# Altium schematic sheet Input Filtering.SchDoc
size A4
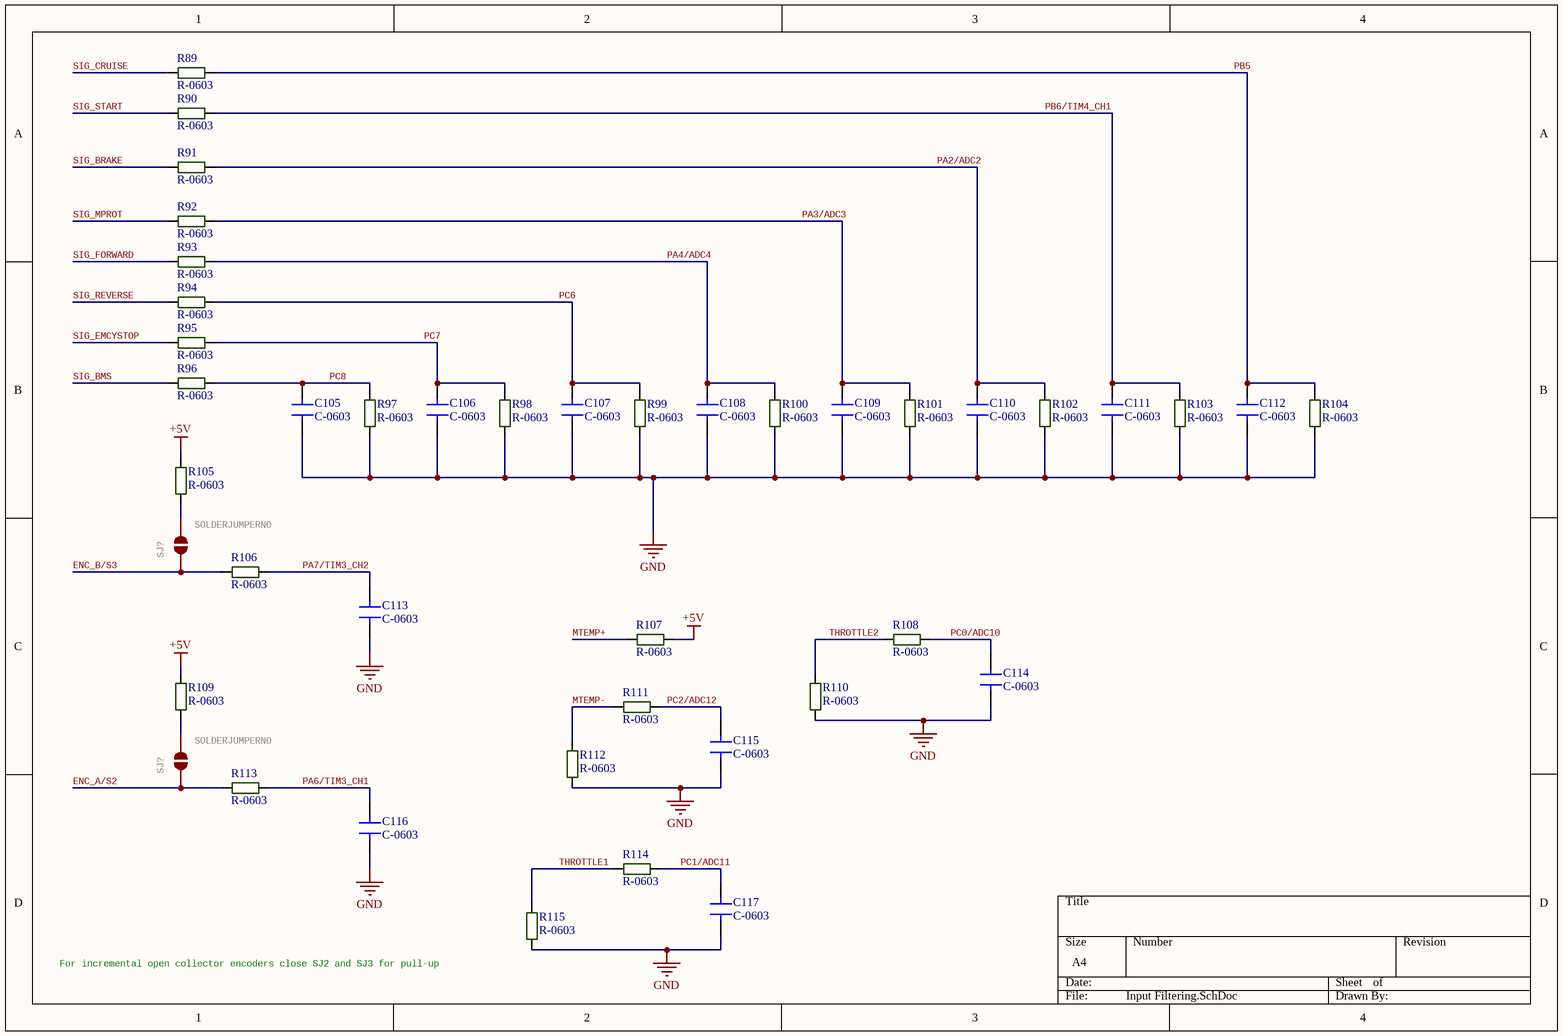
[diagram p0: Input Filtering.SchDoc]

## Parts
(Parts that share a designator on the sheet are numbered #1, #2 ... from top to bottom, then left to right.)
C105  C-0603  [C-0603W]
C106  C-0603  [C-0603W]
C107  C-0603  [C-0603W]
C108  C-0603  [C-0603W]
C109  C-0603  [C-0603W]
C110  C-0603  [C-0603W]
C111  C-0603  [C-0603W]
C112  C-0603  [C-0603W]
C113  C-0603  [C-0603W]
C114  C-0603  [C-0603W]
C115  C-0603  [C-0603W]
C116  C-0603  [C-0603W]
C117  C-0603  [C-0603W]
R89  R-0603  [R-0603R]
R90  R-0603  [R-0603R]
R91  R-0603  [R-0603R]
R92  R-0603  [R-0603R]
R93  R-0603  [R-0603R]
R94  R-0603  [R-0603R]
R95  R-0603  [R-0603R]
R96  R-0603  [R-0603R]
R97  R-0603  [R-0603R]
R98  R-0603  [R-0603R]
R99  R-0603  [R-0603R]
R100  R-0603  [R-0603R]
R101  R-0603  [R-0603R]
R102  R-0603  [R-0603R]
R103  R-0603  [R-0603R]
R104  R-0603  [R-0603R]
R105  R-0603  [R-0603R]
R106  R-0603  [R-0603R]
R107  R-0603  [R-0603R]
R108  R-0603  [R-0603R]
R109  R-0603  [R-0603R]
R110  R-0603  [R-0603R]
R111  R-0603  [R-0603R]
R112  R-0603  [R-0603R]
R113  R-0603  [R-0603R]
R114  R-0603  [R-0603R]
R115  R-0603  [R-0603R]
SJ?#1  SOLDERJUMPERNO  [SJ_2S-NO]
SJ?#2  SOLDERJUMPERNO  [SJ_2S-NO]

## Nets
+5V: R105.2 R107.2 R109.2
GND: C105.1 C106.1 C107.1 C108.1 C109.1 C110.1 C111.1 C112.1 C113.1 C114.1 C115.1 C116.1 C117.1 R97.1 R98.1 R99.1 R100.1 R101.1 R102.1 R103.1 R104.1 R110.1 R112.1 R115.1
ENC_A/S2: R113.1 SJ?#2.1
ENC_B/S3: R106.1 SJ?#1.1
MTEMP+: R107.1
MTEMP-: R111.1 R112.2
PA2/ADC2: C110.2 R91.2 R102.2
PA3/ADC3: C109.2 R92.2 R101.2
PA4/ADC4: C108.2 R93.2 R100.2
PA6/TIM3_CH1: C116.2 R113.2
PA7/TIM3_CH2: C113.2 R106.2
PB5: C112.2 R89.2 R104.2
PB6/TIM4_CH1: C111.2 R90.2 R103.2
PC0/ADC10: C114.2 R108.2
PC1/ADC11: C117.2 R114.2
PC2/ADC12: C115.2 R111.2
PC6: C107.2 R94.2 R99.2
PC7: C106.2 R95.2 R98.2
PC8: C105.2 R96.2 R97.2
SIG_BMS: R96.1
SIG_BRAKE: R91.1
SIG_CRUISE: R89.1
SIG_EMCYSTOP: R95.1
SIG_FORWARD: R93.1
SIG_MPROT: R92.1
SIG_REVERSE: R94.1
SIG_START: R90.1
THROTTLE1: R114.1 R115.2
THROTTLE2: R108.1 R110.2
NetR105_1: R105.1 SJ?#1.2
NetR109_1: R109.1 SJ?#2.2

## Notes on the sheet
- For incremental open collector encoders close SJ2 and SJ3 for pull-up

## Library data of the parts
SJ?#1 SJ?#2 = SOLDERJUMPERNO: Solder JumperStandard SMD solder jumper. Used to automate production. Two varients : Normally Open and Normally Closed are the same, but have different paste layers. NC will have a large amount of paste and should jumper during reflow.; GateName_1: 1; SymbolName_1: SJ; DeviceName: NO; LibraryName: SparkFun-Passives; DeviceSetName: SOLDERJUMPER